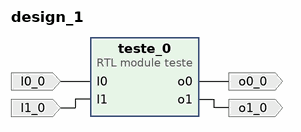
[diagram p0: block diagram of the top level]
# Vivado block design design_1, xc7z010clg400-1, Vivado 2024.2
create_bd_design design_1

create_bd_port -dir O o0_0
create_bd_port -dir O o1_0
create_bd_port -dir I I0_0
create_bd_port -dir I I1_0

create_bd_cell -type module -reference teste teste_0

# ---- connections ----

connect_bd_net -net I0_0_1 [get_bd_ports I0_0] [get_bd_pins teste_0/I0]
connect_bd_net -net I1_0_1 [get_bd_ports I1_0] [get_bd_pins teste_0/I1]
connect_bd_net [get_bd_pins teste_0/o0] [get_bd_ports o0_0]
connect_bd_net [get_bd_pins teste_0/o1] [get_bd_ports o1_0]

validate_bd_design
save_bd_design
